# EAGLE design ISPbreadboardAdapter_ATmega328compatible_v1.2.1 (EAGLE 7.4.0)
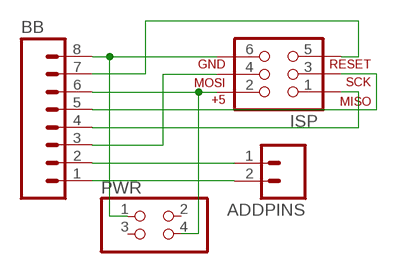
[diagram p0: schematic, sheet 1]

## Parts
ADDPINS  M02PTH  [1X02]
BB  M08  [1X08_ROUND]
ISP  AVR_SPI_PRG_6PTH  [2X3]
PWR  PINHD-2X2  [2X02]

## Nets
GND: BB.8 ISP.6 PWR.1
MISO: BB.4 ISP.1
MOSI: BB.3 ISP.4
N$1: ADDPINS.1 BB.2
N$2: ADDPINS.2 BB.1
RST: BB.7 ISP.5
SCK: BB.5 ISP.3
VCC: BB.6 ISP.2 PWR.4
Unconnected: PWR.2 PWR.3

## Library data of the parts
ADDPINS = SparkFun-Connectors:M02: Standard 2-pin 0.1" header. Use with - straight break away headers ( PRT-00116) - right angle break away headers (PRT-00553) - swiss pins (PRT-00743) - machine pins (PRT-00117) - female headers (PRT-00115) Molex polarized connector foot print use with: PRT-08233 with associated crimp pins and housings. 2.54_SCREWTERM for use with PRT-10571. 3.5mm Screw Terminal footprints for PRT-08084 5mm Screw Terminal footprints for use with PRT-08432
BB = SparkFun-Connectors:M08: Header 8 Standard 8-pin 0.1" header. Use with straight break away headers (SKU : PRT-00116), right angle break away headers (PRT-00553), swiss pins (PRT-00743), machine pins (PRT-00117), and female headers (PRT-00115).
ISP = SparkFun-Connectors:AVR_SPI_PRG_6: AVR ISP 6 Pin This is the reduced ISP connector for AVR programming. Common on Arduino. This footprint will take up less PCB space and can be used with a 10-pin to 6-pin adapter such as SKU: BOB-08508 **Special note about "TEST_POINT" package. The stop mask is on the top side, so if you want your programming test points to be on the bottom of your board, make sure to place this package on the bottom side of the board. This also ensure that the orientation to program from the bottom side will be correct.
PWR = pinhead:PINHD-2X2: PIN HEADER

## Board
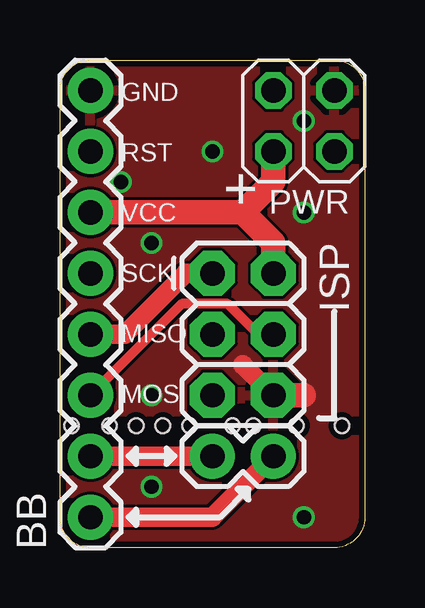
[diagram p1: board, top side]
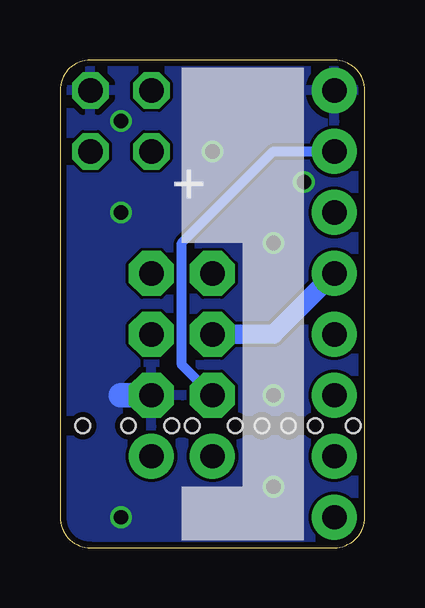
[diagram p2: board, bottom side, seen from below]

Size 12.7 x 20.32 mm. Coordinates in mm from the lower left corner, seen from the top.
Outline: 1.27,20.32 11.43,20.32 arc-90 12.7,19.05 12.7,1.27 arc-90 11.43,0 1.27,0 arc-90 0,1.27 0,19.05 arc-90 1.27,20.32
Copper layers (1*16): Top 0.035mm / dielectric 1.5mm / Bottom 0.035mm
Design rules "dirt_cheap_dirty_boards.v1": minimum track width 5mil, minimum drill 12mil, track to track 5mil, track to pad 5mil, pad to pad 5mil, via to via 5mil, smd to smd 0mil, copper to edge 10mil, drill to drill 10mil, minimum pad ring 10mil, minimum via ring 6mil, stop-mask expansion 2mil, vias tented up to drill 25mil, thermal gap 10mil
Holes 0.6 mm at 0.48,5.08 2.06,5.08 3.17,5.08 4.29,5.08 5.4,5.08 7.19,5.08 8.05,5.08 9.84,5.08 11.75,5.08

### Footprints (pad centres in the part's own frame; a part is rotated, then mirrored left to right if it is on the bottom)
1X02 = drill 1.016 pad 1.88: 1 0,0; 2 2.54,0
1X08_ROUND = drill 1.016 pad 1.88: 1 0,0; 2 2.54,0; 3 5.08,0; 4 7.62,0; 5 10.16,0; 6 12.7,0; 7 15.24,0; 8 17.78,0
2X3 = drill 1.016 pad 1.88 octagon: 1 0,0; 2 0,2.54; 3 2.54,0; 4 2.54,2.54; 5 5.08,0; 6 5.08,2.54
2X02 = drill 1.016 octagon: 1 -1.27,-1.27; 2 -1.27,1.27; 3 1.27,-1.27; 4 1.27,1.27

### Placement (x,y rotation side)
ADDPINS  6.35,3.81 0 top
BB  1.27,1.27 90 top
ISP  6.35,11.43 270 top
PWR  10.16,17.78 180 top

### Tracks (layer width: path | path; a pad name or v marks a point on that pad's centre or on a via)
GND  (via drill 0.6)
  Top 0.813: ISP.6 7.62,7.62
  Top 1.016: ISP.6 10.16,6.35
  Bottom 1.016: ISP.6 10.16,6.35
  other vias: 3.81,12.7 3.81,6.35 6.35,16.51 10.16,13.97 2.54,15.24 10.16,17.78 3.81,2.54 10.16,1.27
  pour Top: 0,0 12.7,0 12.7,20.32 0,20.32
  pour Bottom: 0,20.32 0,0 12.7,0 12.7,20.32
MISO
  Top 0.813: ISP.1 5.24,11.43 2.7,8.89 BB.4
MOSI
  Top 0.406: ISP.4 8.26,8.89 6.99,10.16 5.08,10.16 BB.3
N$1
  Top 0.813: ADDPINS.1 BB.2
N$2
  Top 0.813: ADDPINS.2 6.35,1.27 BB.1
RST
  Bottom 0.406: ISP.5 7.62,7.62 7.62,12.7 3.81,16.51 BB.7
SCK
  Bottom 0.813: ISP.3 3.81,8.89 BB.5
VCC
  Top 1.016: 7.62,13.97 8.89,12.7 ISP.2 | 7.62,13.97 8.89,15.24 PWR.4 | 7.62,13.97 BB.6

### Text on the board
tNames: + | GND / RST / VCC / SCK / MISO / MOSI
bNames: +